# EAGLE design luchador (EAGLE 7.2.0)
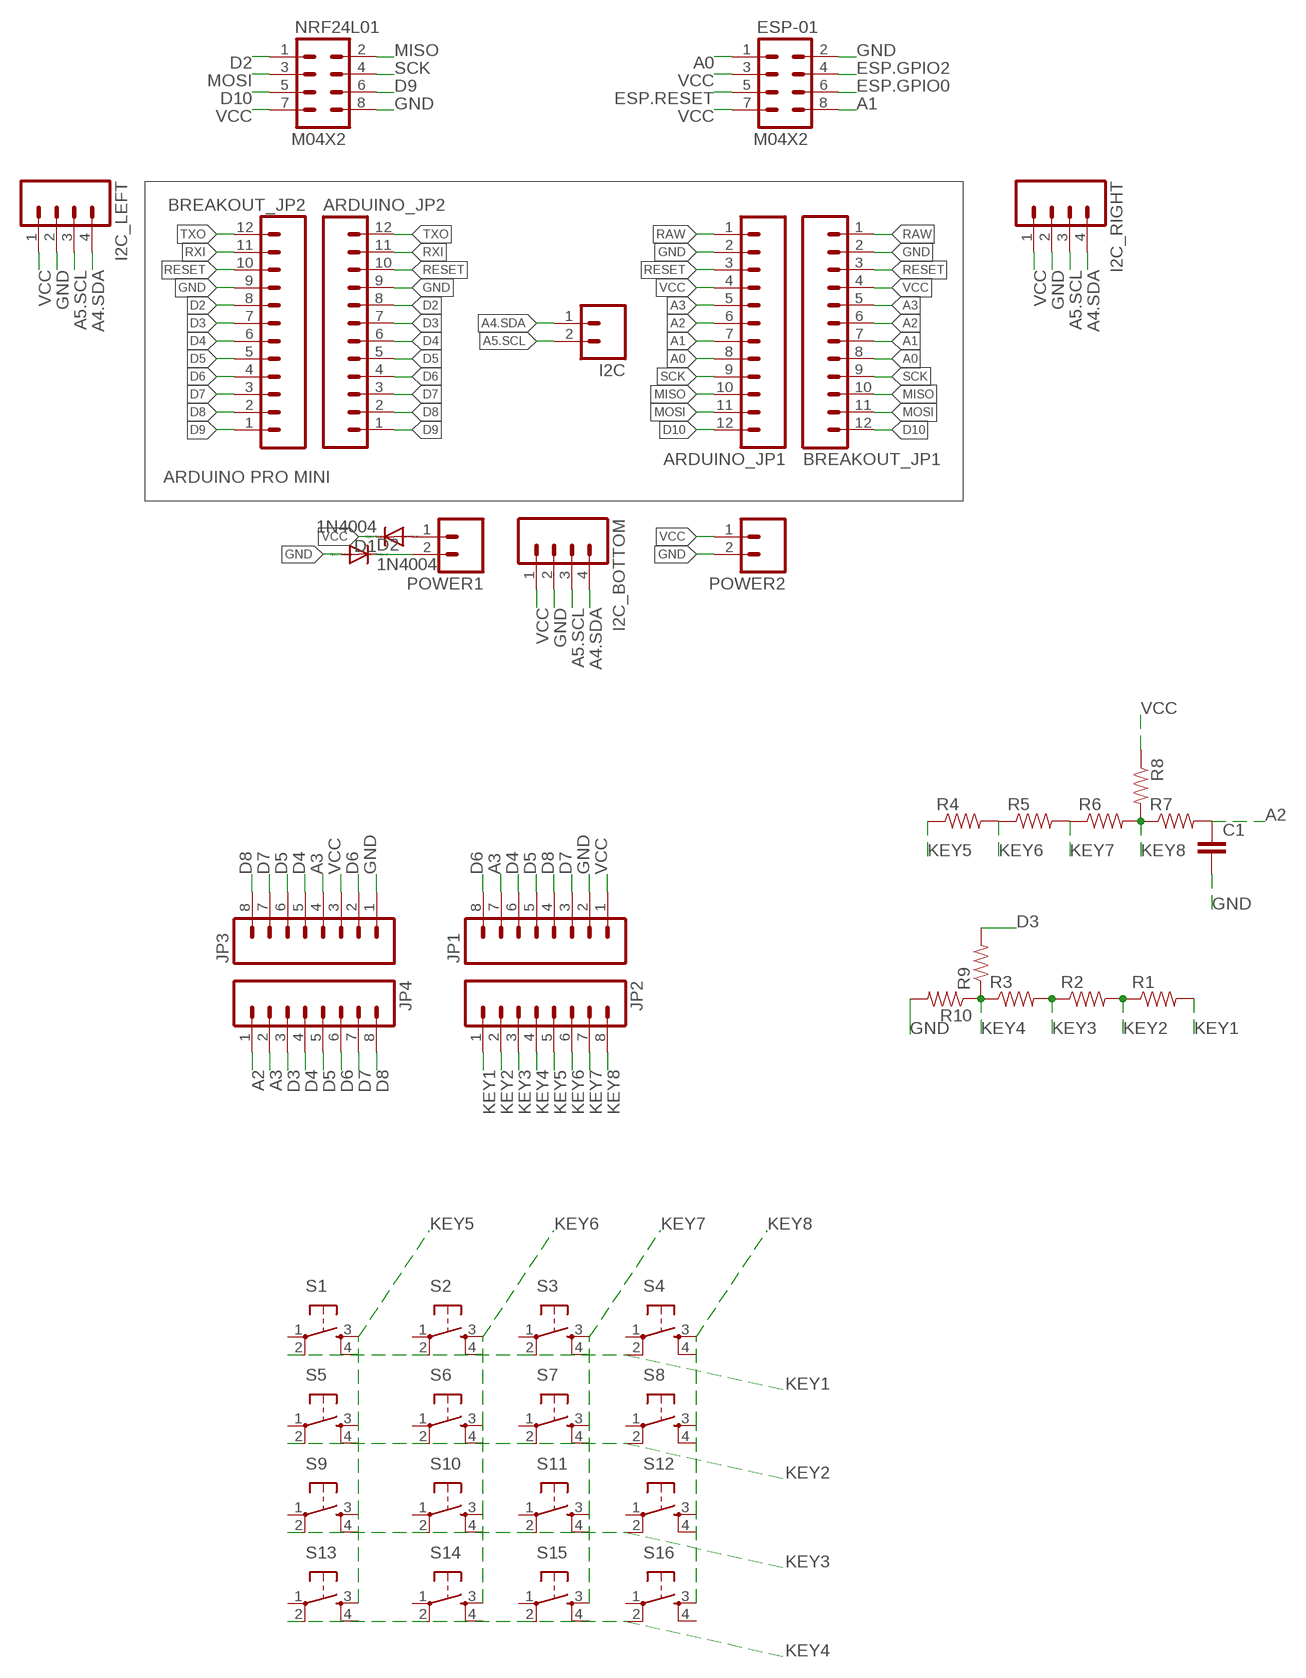
[diagram p0: schematic, sheet 1]

## Parts
ARDUINO_JP1  M12PTH  [1X12]
ARDUINO_JP2  M12PTH  [1X12]
BREAKOUT_JP1  M12PTH  [1X12]
BREAKOUT_JP2  M12PTH  [1X12]
C1  CAP_  [AXIAL-5MM]
D1  1N4004  [DO41-10]
D2  1N4004  [DO41-10]
ESP-01  M04X2  [2X4]
I2C  M02PTH  [1X02]
I2C_BOTTOM  M04PTH  [1X04]
I2C_LEFT  M04PTH  [1X04]
I2C_RIGHT  M04PTH  [1X04]
JP1  M08SILK_FEMALE_PTH  [1X08]
JP2  M08SILK_FEMALE_PTH  [1X08]
JP3  M08SILK_FEMALE_PTH  [1X08]
JP4  M08SILK_FEMALE_PTH  [1X08]
NRF24L01  M04X2  [2X4]
POWER1  M02PTH  [1X02]
POWER2  M02PTH  [1X02]
R1  RESISTORAXIAL-0.3  [AXIAL-0.3]
R2  RESISTORAXIAL-0.3  [AXIAL-0.3]
R3  RESISTORAXIAL-0.3  [AXIAL-0.3]
R4  RESISTORAXIAL-0.3  [AXIAL-0.3]
R5  RESISTORAXIAL-0.3  [AXIAL-0.3]
R6  RESISTORAXIAL-0.3  [AXIAL-0.3]
R7  RESISTORAXIAL-0.3  [AXIAL-0.3]
R8  RESISTORAXIAL-0.3  [AXIAL-0.3]
R9  RESISTORAXIAL-0.3  [AXIAL-0.3]
R10  RESISTORAXIAL-0.3  [AXIAL-0.3]
S1  TAC_SWITCHPTH  [TACTILE-PTH]
S2  TAC_SWITCHPTH  [TACTILE-PTH]
S3  TAC_SWITCHPTH  [TACTILE-PTH]
S4  TAC_SWITCHPTH  [TACTILE-PTH]
S5  TAC_SWITCHPTH  [TACTILE-PTH]
S6  TAC_SWITCHPTH  [TACTILE-PTH]
S7  TAC_SWITCHPTH  [TACTILE-PTH]
S8  TAC_SWITCHPTH  [TACTILE-PTH]
S9  TAC_SWITCHPTH  [TACTILE-PTH]
S10  TAC_SWITCHPTH  [TACTILE-PTH]
S11  TAC_SWITCHPTH  [TACTILE-PTH]
S12  TAC_SWITCHPTH  [TACTILE-PTH]
S13  TAC_SWITCHPTH  [TACTILE-PTH]
S14  TAC_SWITCHPTH  [TACTILE-PTH]
S15  TAC_SWITCHPTH  [TACTILE-PTH]
S16  TAC_SWITCHPTH  [TACTILE-PTH]

## Nets
A0: ARDUINO_JP1.8 BREAKOUT_JP1.8 ESP-01.1
A1: ARDUINO_JP1.7 BREAKOUT_JP1.7 ESP-01.8
A2: ARDUINO_JP1.6 BREAKOUT_JP1.6 C1.P$1 JP4.1 R7.P$2
A3: ARDUINO_JP1.5 BREAKOUT_JP1.5 JP1.7 JP3.4 JP4.2
A4.SDA: I2C.1 I2C_BOTTOM.4 I2C_LEFT.4 I2C_RIGHT.4
A5.SCL: I2C.2 I2C_BOTTOM.3 I2C_LEFT.3 I2C_RIGHT.3
D2: ARDUINO_JP2.8 BREAKOUT_JP2.8 NRF24L01.1
D3: ARDUINO_JP2.7 BREAKOUT_JP2.7 JP4.3 R9.P$2
D4: ARDUINO_JP2.6 BREAKOUT_JP2.6 JP1.6 JP3.5 JP4.4
D5: ARDUINO_JP2.5 BREAKOUT_JP2.5 JP1.5 JP3.6 JP4.5
D6: ARDUINO_JP2.4 BREAKOUT_JP2.4 JP1.8 JP3.2 JP4.6
D7: ARDUINO_JP2.3 BREAKOUT_JP2.3 JP1.3 JP3.7 JP4.7
D8: ARDUINO_JP2.2 BREAKOUT_JP2.2 JP1.4 JP3.8 JP4.8
D9: ARDUINO_JP2.1 BREAKOUT_JP2.1 NRF24L01.6
D10: ARDUINO_JP1.12 BREAKOUT_JP1.12 NRF24L01.5
ESP.GPIO0: ESP-01.6
ESP.GPIO2: ESP-01.4
ESP.RESET: ESP-01.5
GND [vcc]: ARDUINO_JP1.2 ARDUINO_JP2.9 BREAKOUT_JP1.2 BREAKOUT_JP2.9 C1.P$2 D2.A ESP-01.2 I2C_BOTTOM.2 I2C_LEFT.2 I2C_RIGHT.2 JP1.2 JP3.1 NRF24L01.8 POWER2.2 R10.P$2
KEY1: JP2.1 R1.P$2 S1.2 S2.2 S3.2 S4.2
KEY2: JP2.2 R1.P$1 R2.P$2 S5.2 S6.2 S7.2 S8.2
KEY3: JP2.3 R2.P$1 R3.P$2 S9.2 S10.2 S11.2 S12.2
KEY4: JP2.4 R3.P$1 R9.P$1 R10.P$1 S13.2 S14.2 S15.2 S16.2
KEY5: JP2.5 R4.P$1 S1.3 S5.3 S9.3 S13.3
KEY6: JP2.6 R4.P$2 R5.P$1 S2.3 S6.3 S10.3 S14.3
KEY7: JP2.7 R5.P$2 R6.P$1 S3.3 S7.3 S11.3 S15.3
KEY8: JP2.8 R6.P$2 R7.P$1 R8.P$2 S4.3 S8.3 S12.3 S16.3
MISO: ARDUINO_JP1.10 BREAKOUT_JP1.10 NRF24L01.2
MOSI: ARDUINO_JP1.11 BREAKOUT_JP1.11 NRF24L01.3
N$1: D2.C POWER1.2
N$2: D1.A POWER1.1
RAW [vcc]: ARDUINO_JP1.1 BREAKOUT_JP1.1
RESET: ARDUINO_JP1.3 ARDUINO_JP2.10 BREAKOUT_JP1.3 BREAKOUT_JP2.10
RXI: ARDUINO_JP2.11 BREAKOUT_JP2.11
SCK: ARDUINO_JP1.9 BREAKOUT_JP1.9 NRF24L01.4
TXO: ARDUINO_JP2.12 BREAKOUT_JP2.12
VCC [vcc]: ARDUINO_JP1.4 BREAKOUT_JP1.4 D1.C ESP-01.3 ESP-01.7 I2C_BOTTOM.1 I2C_LEFT.1 I2C_RIGHT.1 JP1.1 JP3.3 NRF24L01.7 POWER2.1 R8.P$1
Unconnected: S1.1 S1.4 S2.1 S2.4 S3.1 S3.4 S4.1 S4.4 S5.1 S5.4 S6.1 S6.4 S7.1 S7.4 S8.1 S8.4 S9.1 S9.4 S10.1 S10.4 S11.1 S11.4 S12.1 S12.4 S13.1 S13.4 S14.1 S14.4 S15.1 S15.4 S16.1 S16.4

## Notes on the sheet
- ARDUINO PRO MINI

## Library data of the parts
ARDUINO_JP1 ARDUINO_JP2 BREAKOUT_JP1 BREAKOUT_JP2 = SparkFun:M12: Header 12 Standard 12-pin 0.1" header. Use with straight break away headers (SKU : PRT-00116), right angle break away headers (PRT-00553), swiss pins (PRT-00743), machine pins (PRT-00117), and female headers (PRT-00115).
C1 = SparkFun-Capacitors:CAP: Capacitor Standard 0603 ceramic capacitor, and 0.1" leaded capacitor.
D1 D2 = diode:1N4004: DIODE general purpose rectifier, 1 A
ESP-01 NRF24L01 = SparkFun:M04X2
I2C POWER1 POWER2 = SparkFun:M02: Header 2 Standard 2-pin 0.1" header. Use with straight break away headers (SKU : PRT-00116), right angle break away headers (PRT-00553), swiss pins (PRT-00743), machine pins (PRT-00117), and female headers (PRT-00115). Molex polarized connector foot print use with SKU : PRT-08233 with associated crimp pins and housings.
I2C_BOTTOM I2C_LEFT I2C_RIGHT = SparkFun-Connectors:M04: Header 4 Standard 4-pin 0.1" header. Use with straight break away headers (SKU : PRT-00116), right angle break away headers (PRT-00553), swiss pins (PRT-00743), machine pins (PRT-00117), and female headers (PRT-00115). Molex polarized connector foot print use with SKU : PRT-08231 with associated crimp pins and housings. 1MM SMD Version SKU: PRT-10208
JP1-JP4 = SparkFun-Connectors:M08: Header 8 Standard 8-pin 0.1" header. Use with straight break away headers (SKU : PRT-00116), right angle break away headers (PRT-00553), swiss pins (PRT-00743), machine pins (PRT-00117), and female headers (PRT-00115).; PROD_ID: CONN-08438
R1-R10 = SparkFun-Resistors:RESISTOR: Resistor Basic schematic elements and footprints for 0603, 1206, and PTH resistors.
S1-S16 = SparkFun:TAC_SWITCH: Momentary Switch Button commonly used for reset or general input. Spark Fun Electronics SKU : COM-00097

## Net classes
0 default: width 0.254 mm, clearance 0.205 mm
1 vcc: width 0.305 mm, clearance 0.205 mm to class 0, clearance 0.205 mm

## Board
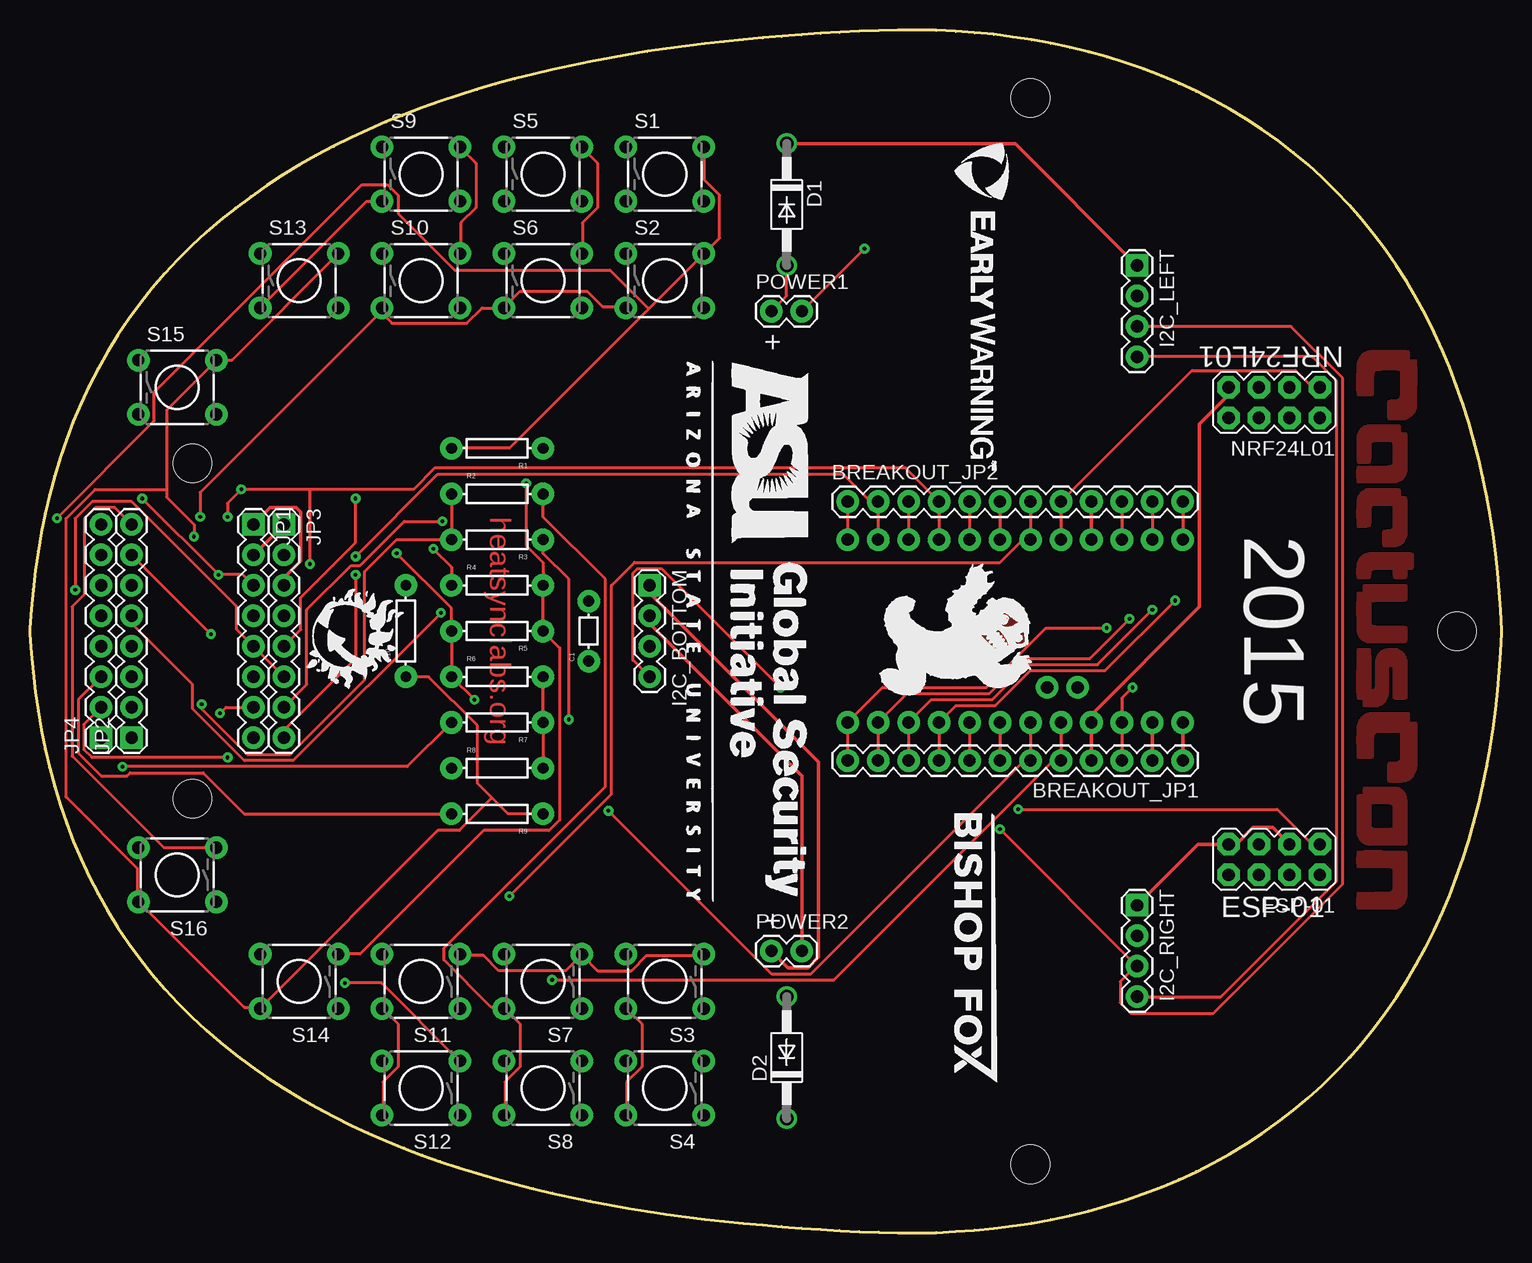
[diagram p1: board, top side]
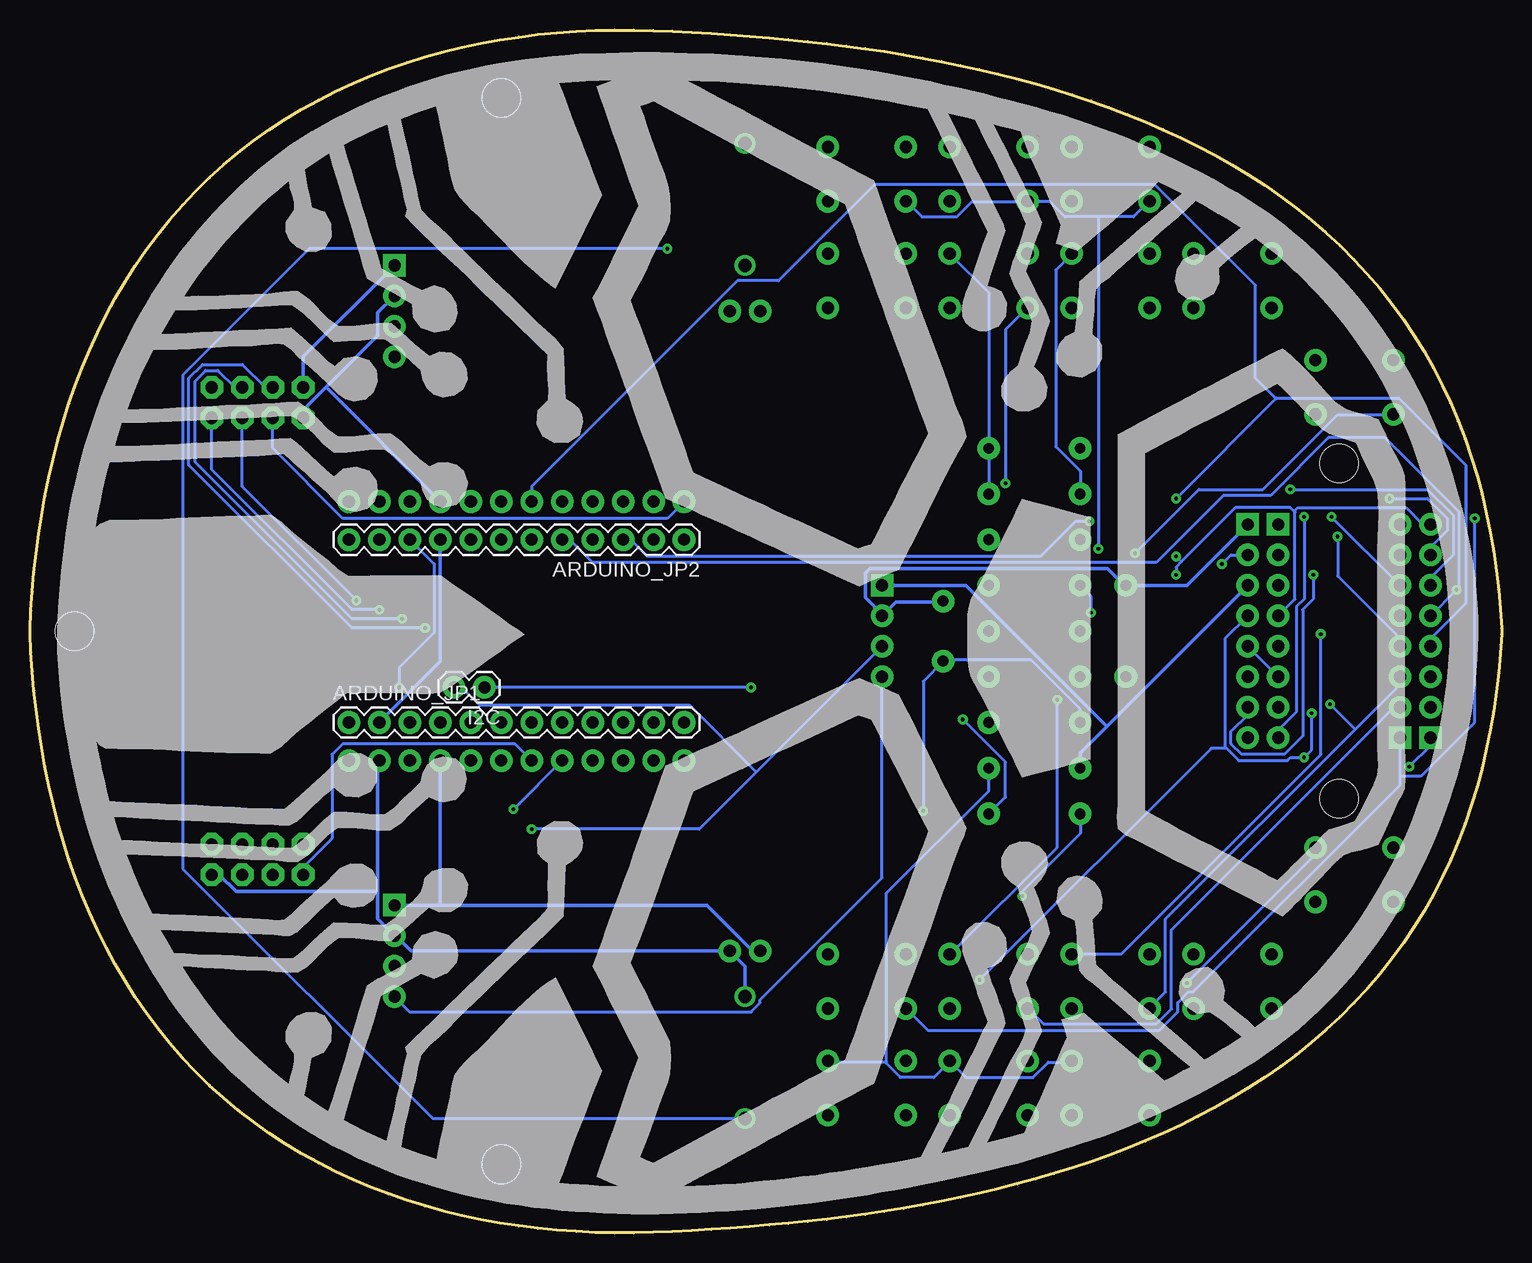
[diagram p2: board, bottom side, seen from below]

Size 122.68 x 100.28 mm. Coordinates in mm from the lower left corner, seen from the top.
Outline: 224 segments
Copper layers (1*16): Top 0.035mm / dielectric 1.5mm / Bottom 0.035mm
Design rules "MayhewLabsPCB *": minimum track width 10mil, minimum drill 12mil, track to track 8mil, track to pad 8mil, pad to pad 8mil, via to via 8mil, smd to smd 6mil, copper to edge 15mil, drill to drill 8mil, minimum pad ring 12mil, minimum via ring 10mil, stop-mask expansion 4mil, vias tented up to drill 25mil, thermal gap 10mil
Holes 3.2 mm at 13.55,64.14 13.55,36.2 118.96,50.17 83.4,5.72 83.4,94.62

### Footprints (pad centres in the part's own frame; a part is rotated, then mirrored left to right if it is on the bottom)
1X12 = drill 1.016 pad 1.88: 1 0,0; 2 2.54,0; 3 5.08,0; 4 7.62,0; 5 10.16,0; 6 12.7,0; 7 15.24,0; 8 17.78,0; 9 20.32,0; 10 22.86,0; 11 25.4,0; 12 27.94,0
AXIAL-5MM = drill 0.9 pad 1.88: P$1 -2.5,0; P$2 2.5,0
DO41-10 = drill 1.118: A 5.08,0; C -5.08,0
2X4 = drill 1.016 pad 1.88 octagon: 1 -3.81,-1.27; 2 -3.81,1.27; 3 -1.27,-1.27; 4 -1.27,1.27; 5 1.27,-1.27; 6 1.27,1.27; 7 3.81,-1.27; 8 3.81,1.27
1X02 = drill 1.016 pad 1.88: 1 0,0; 2 2.54,0
1X04 = drill 1.016 pad 1.88 square: 1 0,0 | drill 1.016 pad 1.88: 2 2.54,0; 3 5.08,0; 4 7.62,0
1X08 = drill 1.016 pad 1.88 square: 1 0,0 | drill 1.016 pad 1.88: 2 2.54,0; 3 5.08,0; 4 7.62,0; 5 10.16,0; 6 12.7,0; 7 15.24,0; 8 17.78,0
AXIAL-0.3 = drill 0.9 pad 1.88: P$1 -3.81,0; P$2 3.81,0
TACTILE-PTH = drill 1.016 pad 1.88: 1 -3.251,2.261; 2 3.251,2.261; 3 -3.251,-2.261; 4 3.251,-2.261

### Placement (x,y rotation side)
ARDUINO_JP1  96.1,42.55 0 bottom
ARDUINO_JP2  68.16,57.79 180 bottom
BREAKOUT_JP1  96.1,39.38 180 top
BREAKOUT_JP2  68.16,60.97 0 top
C1  46.57,50.17 90 top
D1  63.08,85.73 270 top
D2  63.08,14.61 90 top
ESP-01  103.72,31.12 180 top
I2C  84.8,45.47 180 bottom
I2C_BOTTOM  51.65,53.98 270 top
I2C_LEFT  92.29,80.65 270 top
I2C_RIGHT  92.29,27.31 270 top
JP1  18.63,59.06 270 top
JP2  8.47,41.28 90 top
JP3  21.17,59.06 270 top
JP4  5.93,41.28 90 top
NRF24L01  103.72,69.22 180 top
POWER1  61.81,76.84 0 top
POWER2  61.81,23.5 0 top
R1  38.95,65.41 180 top
R2  38.95,61.6 0 top
R3  38.95,57.79 180 top
R4  38.95,53.98 0 top
R5  38.95,50.17 180 top
R6  38.95,46.36 0 top
R7  38.95,42.55 180 top
R8  38.95,38.74 0 top
R9  38.95,34.93 180 top
R10  31.33,50.17 90 top
S1  52.92,88.27 0 top
S2  52.92,79.38 0 top
S3  52.92,20.96 180 top
S4  52.92,12.07 180 top
S5  42.76,88.27 0 top
S6  42.76,79.38 0 top
S7  42.76,20.96 180 top
S8  42.76,12.07 180 top
S9  32.6,88.27 0 top
S10  32.6,79.38 0 top
S11  32.6,20.96 180 top
S12  32.6,12.07 180 top
S13  22.44,79.38 0 top
S14  22.44,20.96 180 top
S15  12.28,70.49 0 top
S16  12.28,29.85 180 top

### Tracks (layer width: path | path; a pad name or v marks a point on that pad's centre or on a via)
A0  (via drill 0.3)
  Top 0.254: ARDUINO_JP1.8 BREAKOUT_JP1.8 | ESP-01.1 106.89,32.39 103.97,35.31 v82.38,35.31
  Bottom 0.254: BREAKOUT_JP1.8 v82.38,35.31
A1
  Top 0.254: ARDUINO_JP1.7 BREAKOUT_JP1.7
  Bottom 0.254: ESP-01.8 99.91,30.49 97.5,32.9 97.5,39.88 96.61,40.77 82.26,40.77 BREAKOUT_JP1.7
A2  (via drill 0.3)
  Top 0.254: ARDUINO_JP1.6 BREAKOUT_JP1.6 82.89,39.38 65.11,21.6 61.81,21.6 v48.22,35.18 | v7.71,38.87 31.46,38.87 R7.P$2
  Bottom 0.254: JP4.1 5.93,40.65 v7.71,38.87 | R7.P$2 35.14,43.69 39.2,47.76 46.57,47.76 C1.P$1 46.57,47.63 48.22,45.98 v48.22,35.18
A3  (via drill 0.3)
  Top 0.254: ARDUINO_JP1.5 BREAKOUT_JP1.5 85.3,39.38 67.02,21.09 v43.52,21.09 | JP4.2 4.53,42.42 4.53,40.26 5.17,39.63 v16.47,39.63 | JP1.7 16.34,43.82 v15.84,43.31
  Bottom 0.254: 23.01,40.45 23.07,40.52 23.07,49.54 JP3.4 | 23.01,40.45 21.93,39.38 17.87,39.38 17.61,39.63 v16.47,39.63 15.84,40.26 v15.84,43.31 | v43.52,21.09 24.22,40.39 23.07,40.39 23.01,40.45
A4.SDA  (via drill 0.3)
  Top 0.254: v62.57,45.47 52.67,55.38 50.63,55.38 50.25,55 50.25,47.76 I2C_BOTTOM.4 | I2C_LEFT.4 106.89,73.03 108.93,71 108.93,29.34 99.27,19.69 I2C_RIGHT.4
  Bottom 0.254: I2C_BOTTOM.4 51.65,29.6 61.81,19.44 61.81,19.18 62.57,18.42 91.02,18.42 I2C_RIGHT.4 | v62.57,45.47 I2C.1
A5.SCL  (via drill 0.3)
  Top 0.254: v80.86,33.66 I2C_RIGHT.3 92.16,22.23 90.89,20.96 90.89,19.18 91.78,18.29 98.64,18.29 109.43,29.09 109.43,71.25 105.12,75.57 I2C_LEFT.3
  Bottom 0.254: v80.86,33.66 66.89,33.66 62.13,38.42 | I2C_BOTTOM.3 62.13,38.42 | I2C.2 86.7,45.47 85.18,43.95 67.65,43.95 62.19,38.49 62.13,38.42
D2
  Top 0.254: ARDUINO_JP2.8 BREAKOUT_JP2.8 96.86,71.89 105.5,71.89 106.89,70.49 NRF24L01.1
D3  (via drill 0.3)
  Top 0.254: BREAKOUT_JP2.7 ARDUINO_JP2.7 82.76,57.79 80.86,55.89 50.38,55.89 48.47,53.98 48.47,36.58 v39.97,28.07 | R9.P$2 17.87,34.93 14.44,38.36 8.34,38.36 8.09,38.11 5.93,38.11 4.02,40.01 4.02,44.46 JP4.3
  Bottom 0.254: v39.97,28.07 39.97,28.45 35.14,33.28 R9.P$2
D4  (via drill 0.3)
  Top 0.254: BREAKOUT_JP2.6 ARDUINO_JP2.6 | v27.14,61.22 27.14,57.54 22.57,52.96 22.57,50.3 JP3.5
  Bottom 0.254: JP4.4 5.93,49.54 3.01,52.46 3.01,64.01 8.6,69.6 18.76,69.6 18.82,69.54 | v27.14,61.22 18.82,69.54 | JP3.5 JP1.6 | BREAKOUT_JP2.6 80.86,62.24 63.71,79.38 60.29,79.38 52.28,87.38 28.92,87.38 20.53,79 20.53,71.25 18.88,69.6 18.82,69.54
D5  (via drill 0.3)
  Top 0.254: BREAKOUT_JP2.5 ARDUINO_JP2.5 | v3.77,53.6 3.77,59.57 5.17,60.97 8.47,60.97 17.23,52.2 17.23,50.3 JP1.5 JP3.6
  Bottom 0.254: JP4.5 v3.77,53.6 3.52,53.85 3.52,60.08 9.74,66.3 14.44,66.3 19.26,61.47 23.2,61.47 28.79,55.89 75.78,55.89 77.68,57.79 ARDUINO_JP2.5
D6  (via drill 0.3)
  Top 0.254: 23.33,61.98 31.96,61.98 33.74,63.76 72.99,63.76 BREAKOUT_JP2.4 ARDUINO_JP2.4 | 23.33,61.98 v17.61,61.98 16.47,60.84 v16.47,59.7 | 23.33,61.98 v23.33,55.76
  Bottom 0.254: JP4.6 5.93,54.62 4.02,56.52 4.02,59.82 6.18,61.98 v17.61,61.98 | JP1.8 18.63,41.92 17.11,43.44 17.11,52.2 16.47,52.84 v16.47,59.7 | JP3.2 22.57,56.52 v23.33,55.76
D7  (via drill 0.3)
  Top 0.254: BREAKOUT_JP2.3 ARDUINO_JP2.3 | JP1.3 17.74,54.87 v15.71,54.87 v9.36,61.22 | v34.38,59.31 31.2,59.31 27.52,55.63 26.76,55.63 23.07,51.95 23.07,45.73 JP3.7
  Bottom 0.254: JP3.7 21.17,43.19 22.57,41.79 22.57,40.77 21.68,39.88 18.12,39.88 16.6,41.41 16.6,51.95 15.71,52.84 v15.71,54.87 | JP4.7 5.93,57.16 4.53,58.55 4.53,59.57 6.18,61.22 v9.36,61.22 | ARDUINO_JP2.3 72.6,57.79 71.21,56.39 38.44,56.39 35.52,59.31 v34.38,59.31
D8  (via drill 0.3)
  Top 0.254: ARDUINO_JP2.2 BREAKOUT_JP2.2 70.06,60.97 67.78,63.25 34,63.25 v27.14,56.39 | JP3.8 21.17,41.92 27.14,47.88 v27.14,54.87
  Bottom 0.254: v27.14,54.87 27.14,55.5 26.69,55.95 | 26.69,55.95 22.19,60.46 17.61,60.46 17.3,60.14 | 17.3,60.14 17.23,60.08 17.23,52.84 JP1.4 | JP4.8 6.56,59.06 7.96,60.46 16.98,60.46 17.23,60.2 17.3,60.14 | v27.14,56.39 26.76,56.01 26.69,55.95
D9
  Top 0.254: BREAKOUT_JP2.1 ARDUINO_JP2.1
  Bottom 0.254: NRF24L01.6 102.45,65.41 96.61,59.57 69.56,59.57 BREAKOUT_JP2.1
D10  (via drill 0.3)
  Top 0.254: BREAKOUT_JP1.12 ARDUINO_JP1.12 71.08,45.47 79.72,45.47 84.67,50.42 v89.75,50.42
  Bottom 0.254: NRF24L01.5 103.08,70.49 104.99,72.4 108.29,72.4 109.43,71.25 109.43,64.01 95.85,50.42 v89.75,50.42
GND
  Top 0.305: JP3.1 JP1.2 | BREAKOUT_JP2.9 ARDUINO_JP2.9 | BREAKOUT_JP1.2 ARDUINO_JP1.2 | I2C_BOTTOM.2 51.65,50.81 64.35,38.11 POWER2.2
  Bottom 0.305: C1.P$2 46.57,52.58 50.51,52.58 I2C_BOTTOM.2 51.65,51.57 53.05,52.96 53.05,55 52.67,55.38 32.85,55.38 31.46,53.98 R10.P$2 26.25,53.98 JP3.1 | NRF24L01.8 99.91,68.59 98,70.49 | 98,70.49 93.69,74.81 93.69,76.71 I2C_LEFT.2 | 98,70.49 BREAKOUT_JP2.9 | D2.A 63.08,22.23 POWER2.2 64.48,23.5 90.89,23.5 92.16,24.77 I2C_RIGHT.2 93.69,26.17 93.69,28.45 | 93.69,28.45 93.69,39.25 BREAKOUT_JP1.2 | ESP-01.2 106.89,29.85 105.5,28.45 93.81,28.45 93.69,28.45 | ARDUINO_JP2.9 88.48,47.63 ARDUINO_JP1.2
KEY1  (via drill 0.3)
  Top 0.254: R1.P$2 39.97,65.41 51.59,77.03 | 51.59,77.03 56.09,81.54 S2.2 56.22,81.67 57.49,82.94 57.49,86.49 56.22,87.76 56.22,90.43 S1.2 | S4.2 49.74,9.91 49.74,12.58 51.01,13.85 51.01,17.4 49.74,18.67 S3.2 | v2.25,59.57 10.37,67.7 10.37,70.11 27.65,87.38 29.81,87.38 30.69,86.49 30.69,84.97 35.39,80.27 48.35,80.27 51.52,77.09 51.59,77.03
  Bottom 0.254: 8.47,38.11 8.47,37.34 25.74,20.07 26.12,20.07 27.01,19.18 27.01,18.42 28.54,16.9 47.84,16.9 49.62,18.67 S3.2 | 8.47,38.11 JP2.1 | v2.25,59.57 2.25,42.55 6.69,38.11 8.47,38.11
KEY2
  Top 0.254: S6.2 46.06,81.67 46.06,84.21 47.33,85.48 47.33,89.16 46.06,90.43 S5.2 | S8.2 39.58,9.91 39.58,12.58 40.85,13.85 40.85,17.4 39.58,18.67 S7.2 39.46,18.8 38.44,18.8 34.5,22.74 34.5,23.75 47.97,37.22 47.97,54.49 42.76,59.7 R2.P$2
  Bottom 0.254: R2.P$2 R1.P$1 42.76,78.36 45.93,81.54 S6.2 | JP2.2 8.98,43.82 27.52,25.28 27.52,18.67 28.79,17.4 38.19,17.4 39.46,18.67 S7.2
KEY3  (via drill 0.3)
  Top 0.254: R2.P$1 R3.P$2 30.57,57.79 27.9,55.12 27.9,46.11 21.68,39.88 18.12,39.88 14.31,43.69 v14.31,44.07 | S10.2 35.9,81.67 35.9,84.21 37.17,85.48 37.17,89.16 35.9,90.43 S9.2 | S12.2 29.42,9.91 29.42,12.58 30.69,13.85 30.69,17.4 29.42,18.67 S11.2
  Bottom 0.254: R2.P$1 35.14,63.51 37.17,65.54 37.17,80.27 35.9,81.54 S10.2 | JP2.3 8.47,45.73 12.22,41.98 | 12.22,41.98 28.03,26.17 28.03,20.07 29.3,18.8 S11.2 | v14.31,44.07 12.28,42.04 12.22,41.98
KEY4  (via drill 0.3)
  Top 0.254: v13.68,58.04 13.68,59.06 11.39,61.35 11.39,61.98 | 11.39,61.98 11.39,68.59 15.45,72.65 S15.2 15.58,72.78 16.85,72.78 25.61,81.54 S13.2 | R10.P$1 33.23,46.36 37.3,42.3 37.3,37.47 38.5,36.26 | 38.5,36.26 39.84,34.93 R9.P$1 | R3.P$1 42.76,56.65 44.92,54.49 v44.92,42.8 | 38.5,36.26 38.44,36.2 35.77,33.53 34,33.53 19.26,18.8 S14.2 19.14,18.8 17.87,18.8 9.1,27.56 S16.2 8.98,27.69 8.98,30.36 3.01,36.33 3.01,59.57 5.42,61.98 11.39,61.98
  Bottom 0.254: JP2.4 8.47,49.54 13.68,54.74 v13.68,58.04 | v44.92,42.8 41.36,39.25 41.36,36.33 R9.P$1
KEY5  (via drill 0.3)
  Top 0.254: JP2.5 8.47,50.81 13.55,45.73 13.55,43.69 17.87,39.38 21.93,39.38 v34.25,51.69 | S13.3 19.26,77.22 28.03,85.98 29.3,85.98 S9.3 | R4.P$1 35.14,55.5 v33.62,57.03
  Bottom 0.254: v34.25,51.69 34.25,53.09 R4.P$1 | S1.3 49.62,85.98 48.35,84.71 45.43,84.71 44.16,85.98 39.58,85.98 S5.3 39.46,85.98 37.68,85.98 36.41,84.71 33.62,84.71 | 33.62,84.71 30.69,84.71 29.42,85.98 S9.3 | 33.62,84.71 v33.62,57.03
KEY6  (via drill 0.3)
  Top 0.254: S14.3 25.74,23.25 27.52,23.25 37.81,33.53 43.27,33.53 44.16,34.42 44.16,48.77 R5.P$1 R4.P$2 42.76,55.89 41.36,57.28 v41.36,62.49 | v14.18,59.7 14.18,61.73 29.3,76.84 29.3,77.09 S10.3 29.3,76.71 30.19,75.82 36.41,75.82 37.68,77.09 39.46,77.09 S6.3 39.58,77.22 40.85,78.49 46.44,78.49 47.71,77.22 49.62,77.22 S2.3
  Bottom 0.254: v14.18,59.7 JP2.6 | v41.36,62.49 41.36,75.32 39.58,77.09 S6.3
KEY7  (via drill 0.3)
  Top 0.254: v30.57,56.65 35.14,52.08 R5.P$2 R6.P$1 v37.04,44.46 | S11.3 35.9,23.12 37.81,23.12 39.08,21.85 44.66,21.85 45.93,23.12 S7.3 46.06,23.12 47.33,21.85 50.13,21.85 51.4,23.12 56.09,23.12 S3.3 | v15.07,49.92 JP2.7
  Bottom 0.254: v30.57,56.65 25.23,61.98 19.9,61.98 13.68,68.2 9.1,68.2 S15.3 | v15.07,49.92 15.07,39.88 31.71,23.25 35.77,23.25 S11.3 | v37.04,44.46 37.04,32.14 45.93,23.25 S7.3
KEY8  (via drill 0.3)
  Top 0.254: JP2.8 7.07,60.46 5.42,60.46 4.53,59.57 4.53,53.22 3.52,52.2 3.52,39.76 11.14,32.14 15.45,32.14 S16.3 | R8.P$2 R7.P$1 R6.P$2 | v26.25,20.83 29.3,20.83 35.77,14.36 S12.3
  Bottom 0.254: S12.3 35.9,14.23 37.81,14.23 39.08,12.96 44.66,12.96 45.93,14.23 S8.3 46.06,14.23 47.33,12.96 50.13,12.96 51.33,14.17 | 51.33,14.17 51.4,14.23 56.09,14.23 S4.3 | R8.P$2 42.76,36.84 51.27,28.33 51.27,14.23 51.33,14.17 | v26.25,20.83 15.58,31.5 15.58,32.01 S16.3
MISO  (via drill 0.3)
  Top 0.254: BREAKOUT_JP1.10 ARDUINO_JP1.10 75.14,44.46 80.22,44.46 83.15,47.38 88.99,47.38 v93.56,51.95
  Bottom 0.254: NRF24L01.2 107.53,63.63 95.85,51.95 v93.56,51.95
MOSI  (via drill 0.3)
  Top 0.254: BREAKOUT_JP1.11 ARDUINO_JP1.11 73.11,44.96 79.97,44.96 82.89,47.88 88.35,47.88 v91.65,51.19
  Bottom 0.254: NRF24L01.3 105.62,70.49 107.02,71.89 108.04,71.89 108.93,71 108.93,64.27 95.85,51.19 v91.65,51.19
N$1  (via drill 0.3)
  Top 0.254: POWER1.2 v69.56,82.05
  Bottom 0.254: D2.C 89.11,9.53 109.94,30.36 109.94,71.51 99.4,82.05 v69.56,82.05
N$2
  Top 0.254: D1.A 63.08,78.11 POWER1.1
N$3
  pour Top: 114.81,30.59 114.81,30.69 114.81,30.99 114.81,31.08 114.81,31.18 114.81,31.38 114.8,31.48 114.8,31.58 114.79,31.68 114.77,31.78 114.67,31.8 114.57,31.8 114.47,31.8 114.37,31.81 114.27,31.81 114.17,31.81 114.07,31.81 113.97,31.81 113.87,31.81 113.77,31.82 113.67,31.82 113.47,31.82 113.37,31.82 113.17,31.82 113.07,31.82 112.76,31.82 112.67,31.82 112.28,31.82 112.18,31.82 111.6,31.82 111.5,31.82 111.21,31.82 111.11,31.82 111.01,31.82 110.82,31.82 110.72,31.81 110.65,31.79 110.61,31.73 110.6,31.64 110.59,31.55 110.59,31.46 110.59,31.38 110.58,31.29 110.58,31.2 110.58,30.91 110.58,30.81 110.58,30.71 110.59,30.61 110.62,30.51 110.66,30.45 113.01,30.45 113.11,30.45 113.21,30.45 113.31,30.45 113.41,30.44 113.51,30.44 113.59,30.4 113.61,30.3 113.61,30.2 113.61,30.1 113.62,30 113.62,29.9 113.62,29.81 113.62,29.71 113.62,29.23 113.62,29.13 113.62,29.04 113.62,28.94 113.61,28.85 113.61,28.76 113.6,28.66 113.58,28.57 113.53,28.49 113.45,28.43 113.37,28.39 113.27,28.38 113.17,28.38 113.08,28.38 112.98,28.37 112.88,28.37 112.79,28.37 112.69,28.37 112.59,28.37 112.5,28.37 112.4,28.36 112.3,28.36 112.21,28.36 112.11,28.36 112.01,28.36 111.91,28.36 111.82,28.36 111.72,28.36 111.62,28.36 111.53,28.36 111.43,28.36 111.33,28.36 111.23,28.35 111.14,28.35 111.04,28.35 110.94,28.35 110.84,28.35 110.74,28.35 110.65,28.35 110.61,28.28 110.6,28.19 110.59,28.11 110.58,28.02 110.58,27.92 110.58,27.84 110.58,27.75 110.58,27.48 110.58,27.39 110.58,27.31 110.58,27.22 110.59,27.13 110.62,27.05 110.72,27.03 110.81,27.02 110.91,27.02 111.01,27.02 111.11,27.02 111.8,27.02 111.9,27.02 112.2,27.02 112.3,27.02 112.49,27.02 112.58,27.02 112.87,27.02 112.97,27.02 113.16,27.02 113.25,27.02 113.54,27.02 113.64,27.02 113.83,27.02 113.93,27.03 114.01,27.06 114.1,27.1 114.19,27.14 114.27,27.19 114.35,27.25 114.43,27.31 114.5,27.38 114.56,27.45 114.62,27.53 114.67,27.6 114.7,27.68 114.73,27.76 114.76,27.84 114.78,27.93 114.79,28.03 114.8,28.13 114.8,28.23 114.81,28.32 114.81,28.42 114.81,28.52 114.81,28.62 114.81,28.72 114.81,29.01 114.81,29.11
N$4
  pour Top: 114.81,53.96 114.76,53.98 114.71,53.99 114.61,54 114.51,54.01 114.41,54.01 114.31,54.01 114.21,54.01 114.11,54.01 114.01,54.02 113.91,54.02 113.81,54.02 113.71,54.02 113.51,54.02 113.41,54.02 112.12,54.02 112.02,54.02 111.83,54.02 111.73,54.02 111.63,54.02 111.54,54.02 111.44,54.01 111.34,54.01 111.24,54 111.15,53.98 111.12,53.9 111.11,53.82 111.11,53.74 111.11,53.39 110.92,53.39 110.84,53.38 110.74,53.37 110.66,53.35 110.6,53.29 110.59,53.19 110.59,53.09 110.59,52.99 110.59,52.89 110.58,52.79 110.58,52.69 110.58,52.59 110.58,51.5 110.58,51.4 110.58,51.3 110.59,51.2 110.59,51.1 110.59,51 110.59,50.9 110.59,50.8 110.59,50.6 110.59,50.5 110.6,50.4 110.6,50.31 110.6,50.21 110.61,50.11 110.63,50.02 110.66,49.93 110.7,49.85 110.74,49.77 110.79,49.69 110.84,49.62 110.89,49.55 110.96,49.48 111.04,49.42 111.12,49.37 111.21,49.32 111.27,49.29 111.34,49.25 111.41,49.22 111.51,49.22 111.6,49.22 111.8,49.22 111.9,49.22 112.09,49.22 112.19,49.21 112.38,49.21 112.48,49.21 112.67,49.21 112.77,49.21 112.96,49.21 113.06,49.21 113.45,49.21 113.54,49.21 113.74,49.21 113.84,49.21 114.13,49.21 114.23,49.21 114.33,49.21 114.42,49.21 114.52,49.21 114.62,49.22 114.71,49.24 114.78,49.3 114.8,49.4 114.81,49.49 114.81,49.59 114.81,49.68 114.81,49.97 114.81,50.05 114.81,50.14 114.81,50.23 114.81,50.32 114.8,50.41 114.77,50.49 114.68,50.53 114.58,50.54 114.48,50.54 114.38,50.54 114.28,50.55 114.18,50.55 114.08,50.55 113.97,50.55 113.77,50.55 113.67,50.55 113.57,50.55 113.47,50.55 113.37,50.55 113.17,50.56 113.07,50.56 112.98,50.56 112.88,50.56 112.78,50.56 112.69,50.56 112.59,50.56 112.5,50.57 112.4,50.57 112.3,50.57 112.21,50.57 112.11,50.58 112.01,50.59 111.92,50.62 111.87,50.67 111.82,50.74 111.81,50.83 111.81,50.93 111.8,51.03 111.8,51.13 111.8,51.23 111.8,51.33 111.8,51.43 111.8,51.53 111.8,51.63 111.8,51.83 111.8,51.92 111.8,52.02 111.8,52.12 111.8,52.22 111.8,52.32 111.8,52.42 111.81,52.52 111.82,52.62 111.91,52.64 112.01,52.65 112.11,52.65 112.21,52.66 112.31,52.66 112.4,52.66 112.5,52.66 112.6,52.66 112.7,52.67 112.8,52.67 112.89,52.67 112.99,52.67 113.09,52.67 113.19,52.67 113.29,52.67 113.38,52.67 113.48,52.67 113.58,52.67 113.68,52.68 113.78,52.68 113.88,52.68 113.98,52.68 114.08,52.68 114.18,52.68 114.28,52.69 114.38,52.69 114.47,52.69 114.57,52.69 114.67,52.7 114.77,52.72 114.8,52.81 114.81,52.9 114.81,52.99 114.81,53.08 114.81,53.18
N$5
  pour Top: 114.81,47.7 114.79,47.78 114.77,47.85 114.74,47.93 114.72,48.01 114.68,48.09 114.64,48.17 114.59,48.24 114.53,48.3 114.47,48.36 114.41,48.42 114.34,48.47 114.27,48.52 114.2,48.56 114.13,48.6 114.07,48.63 114.01,48.66 113.29,48.66 113.2,48.66 113.1,48.66 113,48.65 112.91,48.63 112.82,48.59 112.73,48.55 112.65,48.5 112.58,48.45 112.51,48.39 112.44,48.32 112.38,48.25 112.33,48.17 112.28,48.09 112.24,48.01 112.21,47.92 112.17,47.84 112.14,47.75 112.14,45.49 112.07,45.38 112.02,45.3 111.94,45.25 111.85,45.26 111.82,45.36 111.81,45.45 111.8,45.55 111.8,45.65 111.8,45.75 111.8,45.85 111.8,45.95 111.8,46.15 111.8,46.25 111.8,47.73 111.79,47.83 111.79,47.93 111.79,48.03 111.79,48.13 111.79,48.23 111.79,48.33 111.78,48.42 111.78,48.52 111.75,48.62 111.67,48.67 111.58,48.67 111.48,48.68 111.1,48.68 111.01,48.68 110.92,48.67 110.82,48.67 110.73,48.67 110.64,48.66 110.6,48.57 110.6,48.47 110.59,48.37 110.59,48.27 110.59,48.17 110.59,48.07 110.59,47.97 110.59,47.87 110.59,47.66 110.59,47.56 110.59,47.36 110.58,47.26 110.58,46.96 110.58,46.86 110.58,46.26 110.58,46.16 110.58,45.76 110.58,45.66 110.58,45.36 110.58,45.26 110.58,45.16 110.58,45.06 110.59,44.96 110.59,44.86 110.6,44.76 110.61,44.66 110.63,44.57 110.7,44.5 110.8,44.49 110.9,44.5 111.11,44.5 111.11,44.23 111.11,44.14 111.11,44.06 111.12,43.98 111.14,43.9 111.22,43.87 111.31,43.86 111.5,43.86 111.59,43.87 111.68,43.87 111.77,43.87 111.87,43.87 111.97,43.87 112.06,43.87 112.16,43.88 112.26,43.88 112.35,43.9 112.45,43.92 112.54,43.95 112.63,44 112.71,44.05 112.8,44.1 112.87,44.17 112.94,44.24 113.01,44.31 113.06,44.39 113.12,44.48 113.16,44.57 113.2,44.66 113.23,44.75 113.25,44.84 113.25,44.93 113.26,45.03 113.26,45.13 113.26,45.22 113.27,45.41 113.27,45.5 113.27,45.6 113.27,45.69 113.27,45.88 113.27,45.98 113.27,46.07 113.27,46.17 113.27,46.27 113.27,46.36 113.27,46.46 113.28,46.55 113.28,46.65 113.28,46.75 113.28,46.84 113.28,46.94 113.29,47.03 113.3,47.13 113.34,47.22 113.41,47.27 113.5,47.26 113.56,47.2 113.59,47.11 113.6,47.02 113.6,46.92 113.61,46.83 113.61,46.64 113.61,46.54 113.61,46.44 113.61,46.35 113.61,46.25 113.61,46.16 113.61,46.06 113.61,45.87 113.62,45.77 113.62,45.67 113.62,45.58 113.62,45.38 113.62,45.29 113.62,45.09 113.62,44.99 113.62,44.8 113.62,44.7 113.62,44.61 113.69,44.55 113.77,44.51 113.86,44.5 113.95,44.5 114.04,44.5 114.13,44.5 114.22,44.5 114.31,44.5 114.39,44.51 114.48,44.51 114.57,44.52 114.66,44.53 114.74,44.56 114.81,44.6
N$6
  pour Top: 114.81,60.81 114.81,60.91 114.81,61.01 114.8,61.1 114.79,61.2 114.76,61.29 114.69,61.35 114.59,61.35 114.5,61.35 114.28,61.35 114.28,61.65 114.28,61.73 114.28,61.82 114.27,61.9 114.24,61.98 114.15,61.99 114.05,62 113.95,62 113.86,62 113.76,62 113.66,62.01 112.98,62.01 112.88,62 112.69,62 112.59,62 112.4,62 112.31,62 112.12,62 112.02,62 111.83,62 111.74,62 111.55,62 111.45,62 111.36,62 111.22,61.92 111.14,61.87 111.06,61.82 110.99,61.76 110.92,61.7 110.86,61.63 110.8,61.55 110.75,61.48 110.71,61.4 110.67,61.31 110.63,61.23 110.61,61.14 110.6,61.04 110.59,60.94 110.59,60.84 110.59,60.74 110.59,60.64 110.59,60.54 110.58,60.44 110.58,60.34 110.58,59.63 110.58,59.53 110.58,59.43 110.59,59.33 110.59,59.23 110.59,59.13 110.6,59.03 110.6,58.93 110.63,58.86 111.46,58.86 111.56,58.87 111.65,58.87 111.74,58.91 111.78,59 111.79,59.1 111.79,59.2 111.8,59.3 111.8,59.98 111.8,60.08 111.8,60.18 111.8,60.28 111.81,60.38 111.84,60.47 111.88,60.56 111.95,60.63 112.04,60.66 112.14,60.68 112.24,60.68 112.33,60.68 112.43,60.69 112.53,60.68 112.73,60.68 112.82,60.68 112.92,60.68 113.02,60.68 113.12,60.68 113.22,60.67 113.31,60.67 113.41,60.66 113.51,60.64 113.6,60.61 113.61,60.51 113.61,60.41 113.61,60.31 113.62,60.21 113.62,60.11 113.62,60.01 113.62,59.91 113.62,59.81 113.62,59.43 113.62,59.34 113.62,59.24 113.62,59.14 113.61,59.05 113.61,58.96 113.6,58.86 113.58,58.77 113.54,58.69 113.46,58.63 113.37,58.6 113.28,58.59 113.18,58.58 113.09,58.57 113.01,58.57 112.92,58.56 112.84,58.55 112.76,58.52 112.73,58.44 112.73,58.34 112.72,58.25 112.72,58.16 112.72,58.07 112.72,57.98 112.72,57.88 112.72,57.79 112.72,57.61 112.73,57.52 112.73,57.43 112.73,57.34 112.75,57.25 112.85,57.23 112.94,57.23 113.04,57.22 113.14,57.22 113.23,57.22 113.33,57.22 113.42,57.22 113.51,57.22 113.6,57.22 113.69,57.22 113.78,57.23 113.87,57.24 113.96,57.25 114.05,57.28 114.14,57.31 114.22,57.35 114.31,57.4 114.39,57.46 114.46,57.52 114.53,57.59 114.59,57.66 114.64,57.74 114.68,57.83 114.72,57.92 114.75,58.01 114.78,58.1 114.79,58.2 114.8,58.29 114.8,58.39 114.81,58.49 114.81,58.58 114.81,58.68 114.81,58.78 114.81,58.97 114.81,59.07
N$7
  pour Top: 201 corners
N$8
  pour Top: 115.37,56.21 115.37,56.3 115.36,56.39 115.36,56.48 115.36,56.57 115.32,56.65 115.23,56.65 115.13,56.66 115.03,56.66 114.93,56.66 114.83,56.66 114.73,56.66 114.64,56.66 114.54,56.66 114.44,56.66 114.24,56.66 114.14,56.67 112.17,56.67 112.07,56.66 111.97,56.66 111.87,56.66 111.78,56.66 111.68,56.66 111.58,56.66 111.48,56.65 111.38,56.64 111.29,56.61 111.2,56.57 111.12,56.52 111.04,56.46 110.97,56.4 110.9,56.34 110.84,56.27 110.78,56.19 110.73,56.11 110.69,56.02 110.66,55.93 110.62,55.83 110.6,55.74 110.6,55.64 110.59,55.55 110.59,55.45 110.58,55.36 110.58,55.26 110.58,55.17 110.58,54.98 110.58,54.88 110.58,54.79 110.59,54.69 110.61,54.6 110.68,54.56 110.78,54.55 110.87,54.55 110.96,54.55 111.05,54.55 111.25,54.55 111.35,54.55 111.45,54.55 111.55,54.56 111.65,54.57 111.74,54.61 111.78,54.7 111.79,54.8 111.8,54.9 111.8,54.98 111.81,55.06 111.83,55.14 111.86,55.21 111.93,55.28 112.02,55.31 112.11,55.33 112.2,55.33 112.3,55.34 112.39,55.34 112.48,55.34 112.57,55.34 113.62,55.34 113.62,54.82 113.63,54.73 113.65,54.64 113.72,54.58 113.81,54.56 113.9,54.55 113.99,54.55 114.18,54.55 114.27,54.55 114.36,54.55 114.45,54.55 114.54,54.56 114.63,54.57 114.72,54.59 114.79,54.64 114.8,54.73 114.81,54.82 114.81,54.91 114.81,55.01 114.81,55.34 115.05,55.34 115.14,55.34 115.24,55.35 115.33,55.39 115.35,55.47 115.36,55.56 115.36,55.66 115.37,55.75 115.37,55.84 115.37,55.94
N$9
  pour Top: 114.81,65.46 114.81,65.56 114.81,65.85 114.81,65.95 114.81,66.05 114.81,66.14 114.81,66.24 114.8,66.34 114.8,66.44 114.79,66.54 114.78,66.63 114.69,66.66 114.61,66.66 114.52,66.66 114.28,66.66 114.28,66.74 114.28,66.9 114.28,66.97 114.27,67.07 114.27,67.16 114.26,67.25 114.2,67.32 114.1,67.33 114,67.34 113.9,67.34 113.8,67.34 113.7,67.34 113.6,67.35 113.39,67.35 113.29,67.35 113.19,67.35 112.99,67.35 112.89,67.35 112.48,67.35 112.38,67.35 112.28,67.35 112.18,67.35 112.08,67.35 111.98,67.35 111.87,67.35 111.77,67.34 111.67,67.34 111.57,67.34 111.47,67.33 111.38,67.31 111.29,67.28 111.2,67.24 111.12,67.19 111.04,67.14 110.97,67.08 110.9,67.01 110.84,66.94 110.77,66.86 110.72,66.78 110.68,66.69 110.65,66.6 110.62,66.51 110.6,66.41 110.6,66.31 110.59,66.21 110.59,66.11 110.59,66.01 110.59,65.91 110.59,65.21 110.59,65.11 110.59,65.01 110.59,64.9 110.59,64.8 110.59,64.7 110.59,64.6 110.6,64.5 110.6,64.4 110.6,64.3 110.63,64.2 110.72,64.19 110.81,64.19 110.9,64.18 110.99,64.18 111.08,64.18 111.36,64.18 111.46,64.18 111.55,64.18 111.65,64.19 111.74,64.22 111.78,64.3 111.79,64.4 111.79,64.5 111.8,64.59 111.8,65.18 111.8,65.28 111.8,65.38 111.8,65.48 111.8,65.58 111.81,65.68 111.83,65.77 111.86,65.86 111.93,65.94 112.01,65.97 112.11,65.98 112.2,65.99 112.29,65.99 112.39,65.99 113.07,65.99 113.37,65.99 113.47,65.98 113.57,65.95 113.58,65.86 113.58,65.76 113.59,65.67 113.59,65.57 113.59,65.48 113.59,65.39 113.59,65.29 113.59,65.2 113.59,64.1 113.53,64.03 113.45,63.96 113.36,63.93 113.27,63.92 113.17,63.91 113.07,63.9 112.97,63.9 112.87,63.89 112.78,63.89 112.68,63.89 112.58,63.89 112.48,63.89 111.99,63.89 111.89,63.89 110.66,63.89 110.62,63.83 110.59,63.75 110.59,63.66 110.58,63.57 110.58,63.48 110.58,63.4 110.58,63.13 110.58,63.05 110.58,62.96 110.58,62.87 110.59,62.78 110.59,62.69 110.6,62.61 110.63,62.54 113.09,62.54 113.19,62.54 113.28,62.54 113.38,62.54 113.48,62.54 113.58,62.55 113.68,62.55 113.78,62.56 113.88,62.57 113.97,62.59 114.07,62.62 114.16,62.66 114.25,62.7 114.34,62.75 114.42,62.82 114.49,62.89 114.56,62.96 114.62,63.05 114.67,63.13 114.71,63.22 114.75,63.32 114.77,63.39 114.79,63.46 114.81,63.52
N$10
  pour Top: 115.66,41.5 115.66,41.6 115.66,41.8 115.65,41.91 115.65,42.01 115.65,42.11 115.65,42.21 115.65,42.31 115.64,42.41 115.62,42.51 115.55,42.56 115.47,42.56 115.38,42.57 115.02,42.57 115.02,43.31 114.95,43.33 114.85,43.34 114.75,43.35 114.55,43.35 114.44,43.35 114.34,43.35 114.24,43.36 113.43,43.36 113.33,43.35 113.13,43.35 113.03,43.35 112.83,43.35 112.73,43.35 112.53,43.35 112.43,43.35 112.33,43.35 112.23,43.35 112.13,43.35 112.03,43.35 111.93,43.34 111.83,43.34 111.73,43.34 111.63,43.33 111.53,43.32 111.44,43.29 111.34,43.25 111.26,43.2 111.17,43.15 111.09,43.09 111.02,43.02 110.95,42.95 110.89,42.87 110.83,42.79 110.79,42.71 110.74,42.63 110.7,42.55 110.67,42.47 110.64,42.39 110.61,42.3 110.6,42.21 110.59,42.11 110.59,42.01 110.59,41.91 110.59,41.82 110.58,41.72 110.58,41.52 110.58,41.42 110.58,40.83 110.58,40.73 110.58,40.53 110.59,40.43 110.59,40.34 110.59,40.24 110.59,40.14 110.59,40.04 110.59,39.94 110.59,39.84 110.6,39.74 110.6,39.65 110.63,39.58 111.55,39.58 111.64,39.58 111.73,39.58 111.81,39.58 111.9,39.59 111.98,39.63 112.02,39.72 112.03,39.81 112.03,39.91 112.03,40 112.03,40.09 112.03,40.87 112.04,40.96 112.04,41.06 112.04,41.16 112.04,41.26 112.05,41.36 112.06,41.46 112.08,41.56 112.13,41.64 112.21,41.7 112.31,41.76 113.52,41.76 113.61,41.76 113.71,41.76 113.8,41.76 113.9,41.76 114,41.75 114.09,41.75 114.19,41.72 114.21,41.63 114.22,41.54 114.22,41.44 114.23,41.35 114.23,41.25 114.23,41.15 114.23,41.06 114.23,39.47 114.18,39.42 114.13,39.37 114.06,39.31 113.98,39.26 113.9,39.23 113.81,39.22 113.72,39.21 113.63,39.21 113.54,39.21 113.35,39.21 113.26,39.2 113.19,39.14 113.16,39.05 113.15,38.96 113.15,38.86 113.14,38.77 113.14,38.2 113.15,38.1 113.15,38.01 113.15,37.91 113.15,37.82 113.16,37.72 113.18,37.62 113.27,37.61 113.36,37.6 113.46,37.6 113.64,37.59 114.02,37.59 114.12,37.6 114.22,37.6 114.31,37.6 114.41,37.61 114.51,37.62 114.6,37.63 114.7,37.65 114.79,37.68 114.88,37.72 114.96,37.77 115.05,37.82 115.13,37.88 115.2,37.94 115.27,38.01 115.34,38.08 115.4,38.16 115.45,38.25 115.49,38.33 115.53,38.42 115.57,38.5 115.59,38.58 115.61,38.67 115.62,38.76 115.63,38.85 115.64,38.95 115.64,39.04 115.64,39.14 115.65,39.24 115.65,39.34 115.65,39.43 115.65,39.53 115.65,39.72 115.65,39.82 115.65,39.92 115.65,40.02 115.66,40.11 115.66,40.31 115.66,40.41
N$11
  pour Top: 114.81,35.27 114.81,35.28 114.81,35.38 114.81,35.58 114.81,35.68 114.81,35.78 114.81,35.88 114.8,35.98 114.8,36.08 114.79,36.18 114.78,36.27 114.75,36.37 114.73,36.45 114.71,36.53 114.67,36.6 114.62,36.67 114.57,36.74 114.51,36.81 114.44,36.87 114.38,36.93 114.3,36.98 114.22,37.03 114.13,37.08 114.03,37.1 113.93,37.12 113.83,37.13 113.73,37.13 113.63,37.14 113.53,37.14 113.43,37.14 113.33,37.14 113.23,37.14 111.16,37.14 111.13,37.08 111.12,37 111.11,36.92 111.11,36.84 111.11,36.76 111.11,36.51 110.92,36.51 110.84,36.51 110.74,36.5 110.66,36.47 110.6,36.41 110.59,36.31 110.59,36.21 110.59,36.11 110.59,36.01 110.59,35.71 110.59,35.61 110.59,35.27 111.8,35.27 111.8,35.31 111.8,35.41 111.81,35.51 111.81,35.61 111.82,35.71 111.84,35.78 111.94,35.78 112.03,35.78 112.13,35.78 112.23,35.78 112.32,35.79 112.42,35.79 112.52,35.79 112.62,35.79 112.71,35.79 113.08,35.79 113.17,35.79 113.26,35.78 113.36,35.78 113.45,35.76 113.53,35.71 113.58,35.64 113.6,35.54 113.61,35.44 113.62,35.34 113.62,35.27
N$12
  pour Top: 114.81,35.27 113.62,35.27 113.62,35.24 113.62,35.15 113.62,35.05 113.62,34.95 113.62,34.75 113.61,34.65 113.61,34.56 113.61,34.47 113.61,34.37 113.61,34.28 113.61,34.19 113.61,34.09 113.61,34 113.6,33.91 113.59,33.82 113.57,33.73 113.49,33.71 113.4,33.7 113.31,33.7 113.21,33.69 113.12,33.69 113.03,33.69 112.39,33.69 112.29,33.69 112.2,33.7 112.11,33.7 112.01,33.71 111.93,33.74 111.87,33.81 111.83,33.88 111.81,33.97 111.81,34.07 111.8,34.16 111.8,34.25 111.8,34.34 111.8,34.91 111.8,35.01 111.8,35.11 111.8,35.21 111.8,35.27 110.59,35.27 110.59,35 110.59,34.9 110.59,34.4 110.59,34.3 110.59,34.1 110.59,34 110.59,33.9 110.59,33.8 110.59,33.7 110.6,33.59 110.6,33.49 110.6,33.39 110.61,33.29 110.62,33.19 110.65,33.1 110.68,33.01 110.73,32.93 110.78,32.85 110.83,32.77 110.89,32.7 110.96,32.63 111.03,32.57 111.1,32.52 111.19,32.47 111.27,32.43 111.36,32.4 111.45,32.37 111.54,32.35 111.64,32.35 111.73,32.34 111.83,32.34 111.93,32.34 112.12,32.34 112.22,32.34 112.31,32.34 112.51,32.34 112.61,32.33 112.8,32.33 112.9,32.34 113.28,32.34 113.38,32.34 113.58,32.34 113.67,32.34 113.77,32.34 113.87,32.34 113.97,32.34 114.06,32.34 114.16,32.34 114.26,32.34 114.36,32.35 114.45,32.35 114.55,32.35 114.65,32.36 114.74,32.39 114.81,32.44
N$13
  pour Top: 79.64,49.39 79.72,49.31 79.8,49.23 79.88,49.15 79.96,49.08 80.04,49 80.13,48.93 80.31,48.79 80.28,48.9 80.27,49.01 80.3,49.12 80.32,49.19 80.27,49.21 80.21,49.19 80.14,49.16 80.04,49.13 79.96,49.17 79.96,49.27 79.99,49.36 80.03,49.43 80.07,49.51 79.99,49.5 79.91,49.48 79.8,49.47 79.74,49.54 79.77,49.63 79.81,49.71 79.85,49.79 79.81,49.84 79.7,49.86 79.58,49.87 79.47,49.86 79.35,49.84 79.34,49.75 79.38,49.67 79.45,49.6 79.51,49.53 79.57,49.46
N$14
  pour Top: 80.55,48.73 80.59,48.83 80.47,48.81 80.38,48.79 80.41,48.71 80.49,48.67
N$15
  pour Top: 80.68,50.01 80.79,50 80.84,49.94 80.81,49.87 80.79,49.8 80.83,49.74 80.93,49.73 81,49.73 81.07,49.72 81.08,49.65 81.05,49.59 81.04,49.5 81.14,49.5 81.22,49.48 81.28,49.42 81.27,49.34 81.23,49.26 81.23,49.18 81.32,49.17 81.4,49.16 81.47,49.14 81.5,49.07 81.46,49.01 81.44,48.95 81.49,48.91 81.59,48.92 81.6,49.04 81.57,49.15 81.52,49.26 81.47,49.37 81.41,49.47 81.35,49.57 81.28,49.67 81.22,49.76 81.16,49.85 81.1,49.94 81.03,50.03 80.96,50.11 80.88,50.19 80.8,50.25 80.69,50.29 80.62,50.25 80.57,50.19 80.52,50.12 80.49,50.05 80.58,50.01
N$16
  pour Top: 80.76,48.38 80.85,48.43 80.91,48.52 80.79,48.53 80.73,48.51 80.71,48.44 80.76,48.38
N$17
  pour Top: 80.95,50.94 81,50.95 80.95,51.06 80.91,51.02 80.95,50.94
N$18
  pour Top: 81.05,50.61 81.14,50.55 81.23,50.5 81.34,50.46 81.45,50.45 81.56,50.45 81.67,50.47 81.78,50.49 81.88,50.53 81.98,50.58 82.08,50.63 82.17,50.69 82.26,50.76 82.35,50.83 82.45,50.91 82.39,50.94 82.28,51 82.23,51.04 82.13,51.1 82.03,51.16 81.94,51.23 81.85,51.3 81.75,51.38 81.66,51.45 81.59,51.51 81.51,51.57 81.44,51.63 81.35,51.68 81.26,51.69 81.17,51.65 81.11,51.58 81.05,51.5 81,51.43 80.95,51.37 81.02,51.4 81.09,51.44 81.16,51.47 81.23,51.48 81.31,51.48 81.38,51.45 81.48,51.39 81.57,51.3 81.61,51.18 81.6,51.05 81.55,50.94 81.47,50.84 81.41,50.79 81.33,50.74 81.25,50.72 81.17,50.71 81.08,50.74 81.01,50.78 80.93,50.82 80.93,50.75 80.98,50.68
N$19
  pour Top: 81.47,51.1 81.51,51.17 81.47,51.27 81.42,51.2
N$20
  pour Top: 82.16,49.2 82.22,49.11 82.31,49.05 82.41,49.02 82.52,49.01 82.62,49.02 82.72,49.06 82.81,49.11 82.89,49.18 82.95,49.25 82.97,49.34 82.97,49.43 82.96,49.52 82.95,49.6 82.94,49.69 82.92,49.8 82.9,49.91 82.88,50.02 82.85,50.13 82.79,50.12 82.73,50.09 82.68,50.05 82.62,50.01 82.54,49.95 82.5,49.87 82.6,49.84 82.68,49.77 82.74,49.69 82.77,49.6 82.75,49.51 82.7,49.44 82.64,49.38 82.57,49.33 82.49,49.28 82.41,49.26 82.31,49.28 82.21,49.31 82.12,49.31
N$21
  pour Top: 82.63,49.61 82.68,49.63 82.63,49.71 82.58,49.69
RAW
  Top 0.305: ARDUINO_JP1.1 BREAKOUT_JP1.1
RESET  (via drill 0.3)
  Top 0.254: BREAKOUT_JP1.3 ARDUINO_JP1.3 91.02,44.58 v91.91,45.47 | BREAKOUT_JP2.10 ARDUINO_JP2.10
  Bottom 0.254: v91.91,45.47 91.91,47.12 88.99,50.04 88.99,55.76 ARDUINO_JP2.10
RXI
  Top 0.254: BREAKOUT_JP2.11 ARDUINO_JP2.11
SCK  (via drill 0.3)
  Top 0.254: BREAKOUT_JP1.9 ARDUINO_JP1.9 77.18,43.95 80.48,43.95 83.4,46.87 89.62,46.87 v95.46,52.71
  Bottom 0.254: NRF24L01.4 104.99,62.24 v95.46,52.71
TXO
  Top 0.254: BREAKOUT_JP2.12 ARDUINO_JP2.12
VCC
  Top 0.305: D1.C 82.13,90.81 I2C_LEFT.1 | JP3.3 21.17,54.62 22.57,56.01 22.57,60.08 22.19,60.46 20.03,60.46 JP1.1 | ESP-01.3 103.59,33.79 101.94,33.79 100.54,32.39 ESP-01.7 99.78,32.39 97.37,32.39 I2C_RIGHT.1 | BREAKOUT_JP1.4 ARDUINO_JP1.4 88.48,42.68 88.48,43.19 97.5,52.2 97.5,67.44 99.91,69.86 NRF24L01.7 | I2C_BOTTOM.1 51.65,53.35 65.75,39.25 65.75,22.99 64.86,22.1 63.21,22.1 POWER2.1
  Bottom 0.305: NRF24L01.7 99.91,73.03 I2C_LEFT.1 | R8.P$1 35.14,40.01 32.92,42.23 | JP3.3 32.92,42.23 | I2C_BOTTOM.1 44.66,53.98 32.98,42.3 32.92,42.23 | POWER2.1 62.44,23.5 66.25,27.31 88.48,27.31 | I2C_RIGHT.1 88.48,27.31 | BREAKOUT_JP1.4 88.48,27.44 88.48,27.31

### Text on the board
Top: heatsynclabs.org
_tsilk: + | NRF24L01 | 2015 | ESP-01 | +